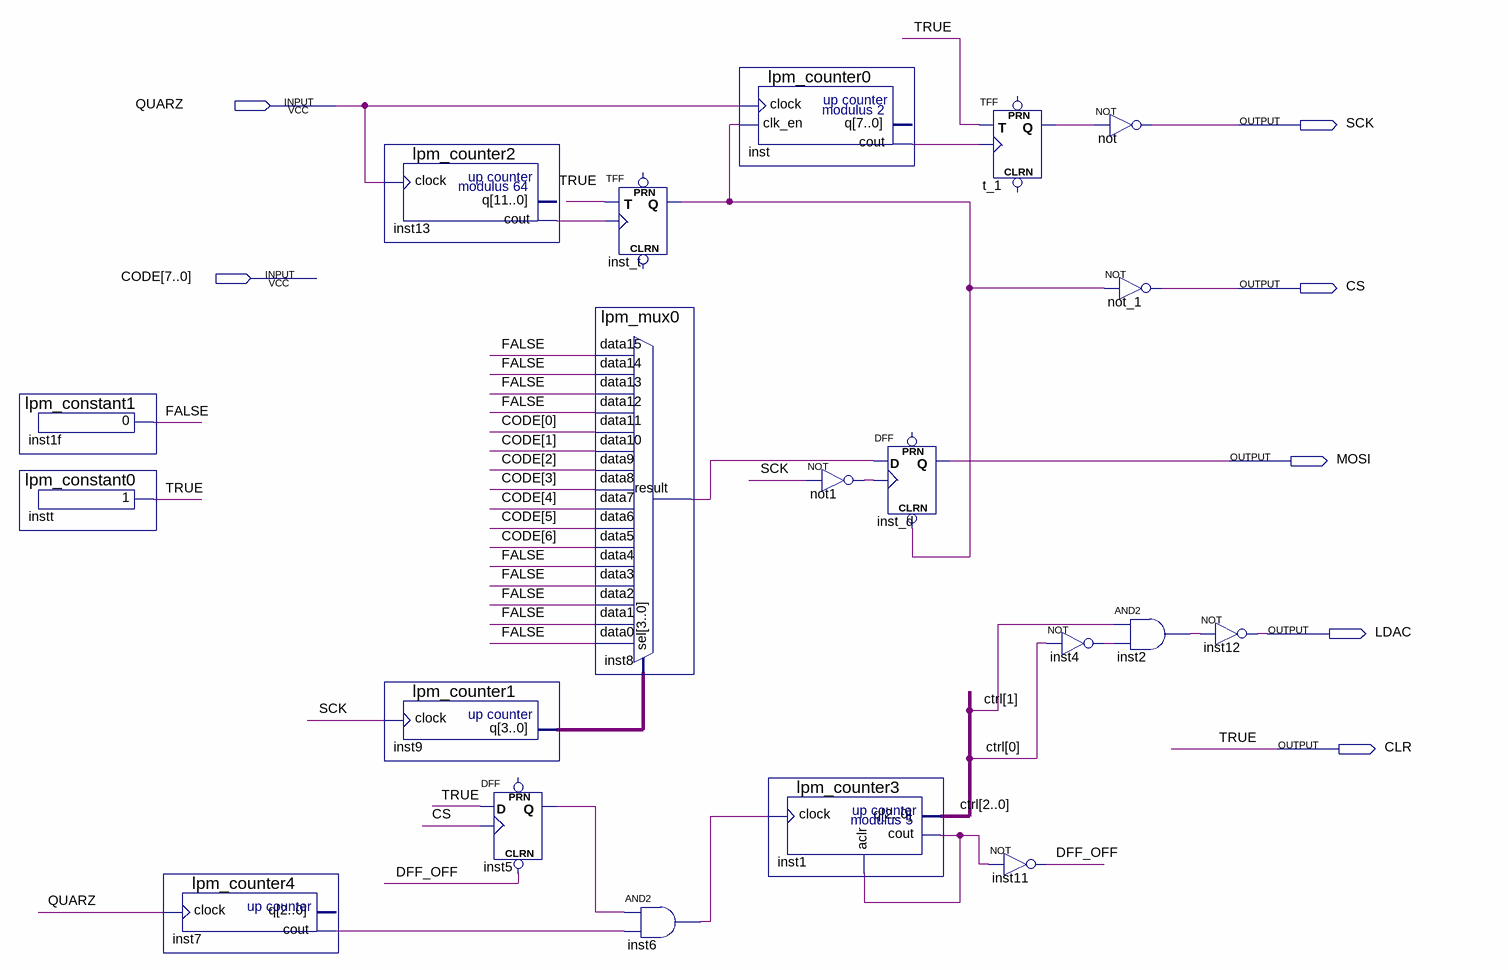
[diagram p0: schematic sheet]
// Quartus schematic lab1.bdf as structural Verilog: 20 symbols, 7 pins
module lab1 (
  input  QUARZ,
  input  [7:0] CODE,
  output SCK,
  output CS,
  output MOSI,
  output LDAC,
  output CLR
);

  wire DFF_OFF, FALSE, inst1_cout, inst2_out, inst4_out, inst5_q, inst6_out, inst7_cout, inst8_result,
       inst13_cout, inst_cout, inst_t_q, not1_out, t_1_q;
  wire [2:0] ctrl;
  wire [3:0] inst9_q;

  lpm_constant1 inst1f (.result(FALSE));
  lpm_constant0 instt (.result(CLR));
  lpm_counter4 inst7 (.clock(QUARZ), .cout(inst7_cout));  // open: q
  lpm_counter2 inst13 (.clock(QUARZ), .cout(inst13_cout));  // open: q
  lpm_counter1 inst9 (.clock(SCK), .q(inst9_q));
  DFF inst5 (.CLRN(DFF_OFF), .CLK(CS), .D(CLR), .Q(inst5_q));  // open: PRN
  TFF inst_t (.T(CLR), .CLK(inst13_cout), .Q(inst_t_q));  // open: PRN, CLRN
  lpm_mux0 inst8 (
    .data15(FALSE), .data14(FALSE), .data13(FALSE), .data12(FALSE), .data11(CODE[0]), .data10(CODE[1]),
    .data9(CODE[2]), .data8(CODE[3]), .data7(CODE[4]), .data6(CODE[5]), .data5(CODE[6]), .data4(FALSE),
    .data3(FALSE), .data2(FALSE), .data1(FALSE), .data0(FALSE), .sel(inst9_q), .result(inst8_result));
  and inst6 (inst6_out, inst5_q, inst7_cout);
  lpm_counter0 inst (.clock(QUARZ), .clk_en(inst_t_q), .cout(inst_cout));  // open: q
  lpm_counter3 inst1 (.clock(inst6_out), .aclr(inst1_cout), .cout(inst1_cout), .q(ctrl));
  not not1 (not1_out, SCK);
  DFF inst_d (.CLRN(inst_t_q), .CLK(not1_out), .D(inst8_result), .Q(MOSI));  // open: PRN
  TFF t_1 (.T(CLR), .CLK(inst_cout), .Q(t_1_q));  // open: PRN, CLRN
  not inst11 (DFF_OFF, inst1_cout);
  not inst4 (inst4_out, ctrl[0]);
  not \not  (SCK, t_1_q);
  not not_1 (CS, inst_t_q);
  and inst2 (inst2_out, ctrl[1], inst4_out);
  not inst12 (LDAC, inst2_out);

  // Other names for the same wires on the sheet: TRUE = CLR
endmodule
